# EAGLE design lighting (EAGLE 7.4.0)
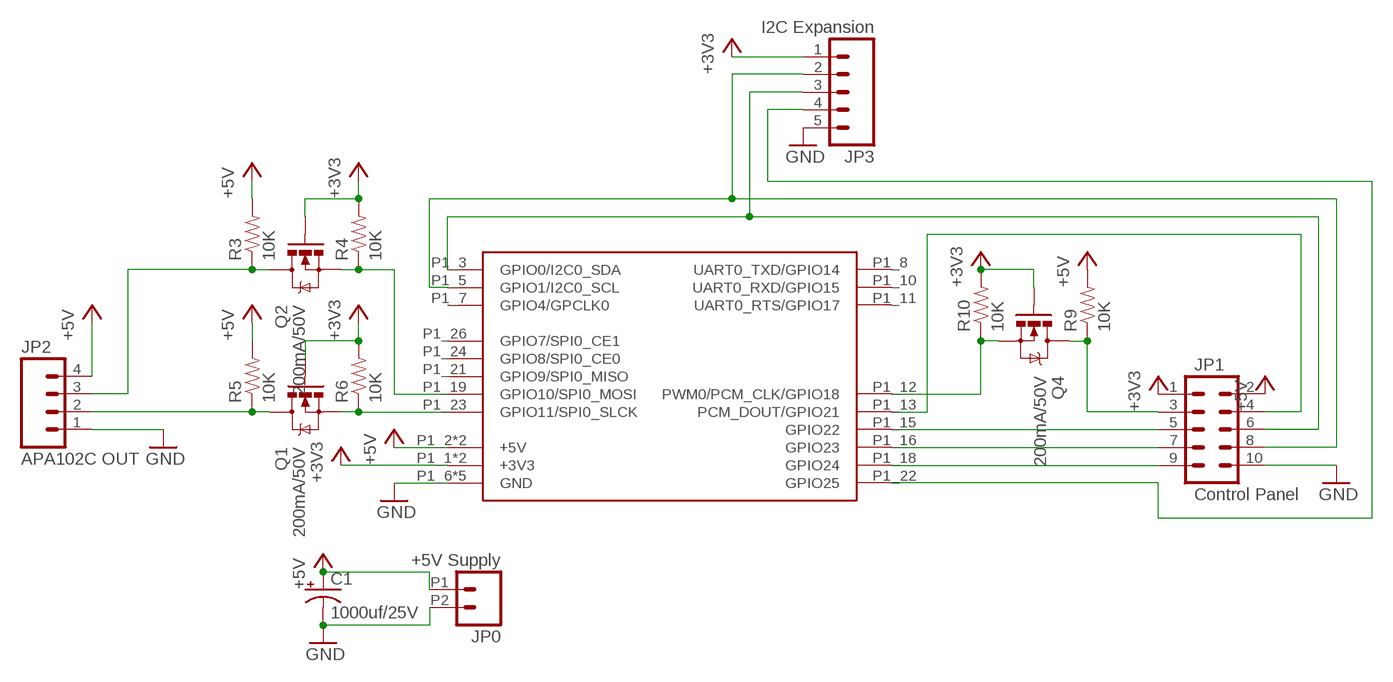
[diagram p0: schematic, sheet 1]

## Parts
C1  1000uf/25V  1000UF-25V(PTH)KIT  [CPOL-RADIAL-1000UF-25V-KIT]
JP0  +5V Supply  M022.54MM_SCREWTERM  [1X02_2.54_SCREWTERM]
JP1  Control Panel  M05X2SHD_LOCK  [2X5-SHROUDED_LOCK]
JP2  APA102C OUT  M04POLAR_LOCK  [MOLEX-1X4_LOCK]
JP3  I2C Expansion  M05LOCK  [1X05_LOCK]
Q1  200mA/50V  MOSFET-NCHANNELBSS138  [SOT23-3]
Q2  200mA/50V  MOSFET-NCHANNELBSS138  [SOT23-3]
Q4  200mA/50V  MOSFET-NCHANNELBSS138  [SOT23-3]
R3  10K  10KOHM-1/10W-1%(0603)0603  [0603-RES]
R4  10K  10KOHM-1/10W-1%(0603)0603  [0603-RES]
R5  10K  10KOHM-1/10W-1%(0603)0603  [0603-RES]
R6  10K  10KOHM-1/10W-1%(0603)0603  [0603-RES]
R9  10K  10KOHM-1/10W-1%(0603)0603  [0603-RES]
R10  10K  10KOHM-1/10W-1%(0603)0603  [0603-RES]
U$1  RPI-B-V1  [RPI-B-V1]

## Nets
+3V3 [Power]: JP1.1 JP3.1 Q1.1(G) Q2.1(G) Q4.1(G) R4.2 R6.2 R10.2 U$1.P1_1(+3V3) U$1.P1_17(+3V3)
+5V [Power]: C1.+ JP0.P1 JP1.2 JP2.4 R3.2 R5.2 R9.2 U$1.P1_2(+5V) U$1.P1_4(+5V)
GND [Power]: C1.- JP0.P2 JP1.10 JP2.1 JP3.5 U$1.P1_6(GND) U$1.P1_9(GND) U$1.P1_14(GND) U$1.P1_20(GND) U$1.P1_25(GND)
N$1: Q2.2(S) R4.1 U$1.P1_19(GPIO10/SPI0_MOSI)
N$2: JP1.5 U$1.P1_15(GPIO22)
N$3: JP1.7 U$1.P1_16(GPIO23)
N$4: JP1.9 U$1.P1_18(GPIO24)
N$5: JP1.6 JP3.3 U$1.P1_3(GPIO0/I2C0_SDA)
N$6: JP1.8 JP3.2 U$1.P1_5(GPIO1/I2C0_SCL)
N$7: Q1.2(S) R6.1 U$1.P1_23(GPIO11/SPI0_SLCK)
N$8: JP3.4 U$1.P1_22(GPIO25)
N$9: JP2.3 Q2.3(D) R3.1
N$11: JP2.2 Q1.3(D) R5.1
N$13: JP1.4 U$1.P1_13(PCM_DOUT/GPIO21)
N$15: JP1.3 Q4.3(D) R9.1
N$16: Q4.2(S) R10.1 U$1.P1_12(PWM0/PCM_CLK/GPIO18)
Unconnected: U$1.P1_7(GPIO4/GPCLK0) U$1.P1_8(UART0_TXD/GPIO14) U$1.P1_10(UART0_RXD/GPIO15) U$1.P1_11(UART0_RTS/GPIO17) U$1.P1_21(GPIO9/SPI0_MISO) U$1.P1_24(GPIO8/SPI0_CE0) U$1.P1_26(GPIO7/SPI0_CE1)

## Library data of the parts
C1 = SparkFun-Capacitors:1000UF-25V(PTH): CAP-08070; PROD_ID: CAP-09538
JP0 = SparkFun-Connectors:M02: Standard 2-pin 0.1" header. Use with - straight break away headers ( PRT-00116) - right angle break away headers (PRT-00553) - swiss pins (PRT-00743) - machine pins (PRT-00117) - female headers (PRT-00115) Molex polarized connector foot print use with: PRT-08233 with associated crimp pins and housings. 2.54_SCREWTERM for use with PRT-10571. 3.5mm Screw Terminal footprints for PRT-08084 5mm Screw Terminal footprints for use with PRT-08432
JP1 = SparkFun-Connectors:M05X2: Header 5x2 Standard 10-pin dual row 0.1" header. Commonly used with AVR-ISP. Use with Spark Fun Electronics SKU: PRT-00778
JP2 = SparkFun-Connectors:M04: Header 4 Standard 4-pin 0.1" header. Use with straight break away headers (SKU : PRT-00116), right angle break away headers (PRT-00553), swiss pins (PRT-00743), machine pins (PRT-00117), and female headers (PRT-00115). Molex polarized connector foot print use with SKU : PRT-08231 with associated crimp pins and housings. 1MM SMD Version SKU: PRT-10208
JP3 = SparkFun-Connectors:M05: Header 5 Standard 5-pin 0.1" header. Use with straight break away headers (SKU : PRT-00116), right angle break away headers (PRT-00553), swiss pins (PRT-00743), machine pins (PRT-00117), and female headers (PRT-00115). Molex polarized connector foot print use with SKU : PRT-08230 with associated crimp pins and housings.
Q1 Q2 Q4 = SparkFun-DiscreteSemi:MOSFET-NCHANNEL: Common NMOSFET Parts MFG P/N Store ID Prod ID FDD8780 TRANS-09984 SI7820DN TRANS-11055 FDS6630A IC-08089 2N7002PW TRANS-11151 FQP30N06L COM-10213 TRANS-10060 BSS123LT1G TRANS-08345 BSS138 TRANS-00830 BS170 2N7000; PROD_ID: TRANS-00830
R3-R6 R9 R10 = SparkFun-Resistors:10KOHM-1/10W-1%(0603): RES-00824; PROD_ID: RES-00824
U$1 = raspberry:RPI-B-V1: First revision of the Model B board without P5 and P6 headers and mounting holes. Choose the "SHIELD" variant for a predefined Dimension layer.

## Net classes
1 Power: width 0.254 mm

## Board
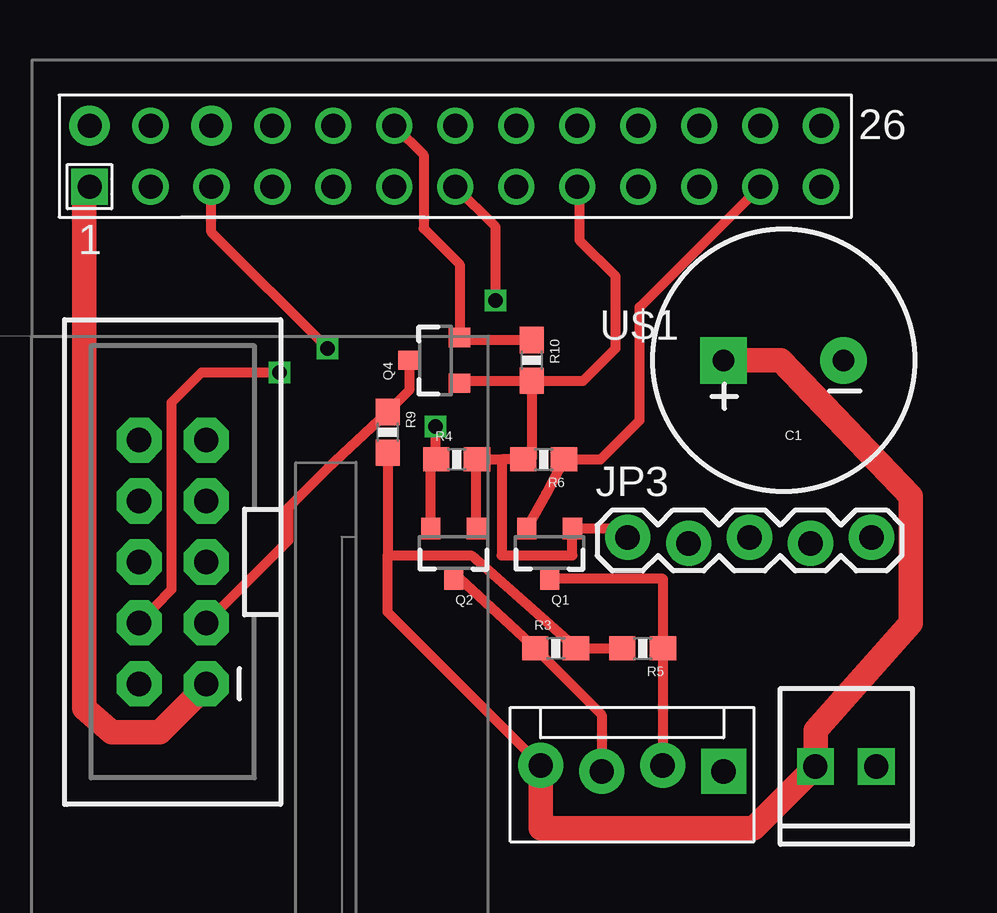
[diagram p1: board, top side]
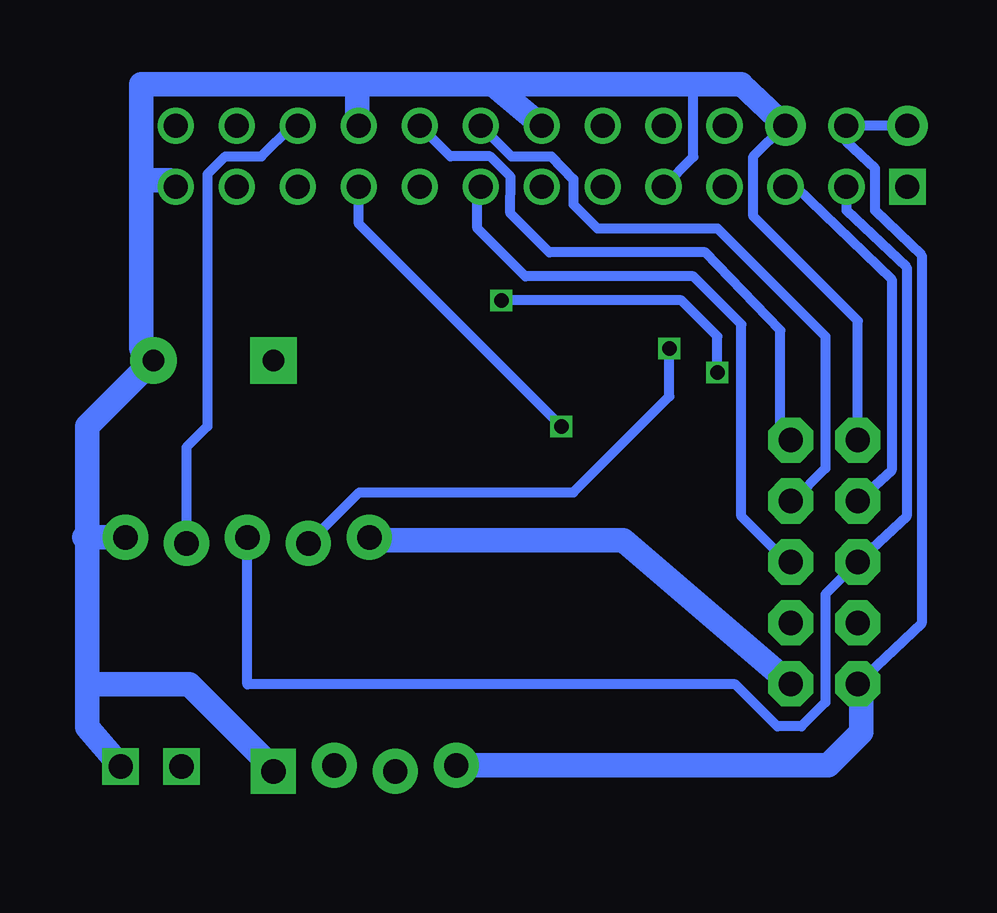
[diagram p2: board, bottom side, seen from below]

No outline drawn. Coordinates in mm, seen from the top.
Copper layers (1*16): Top 0.035mm / dielectric 1.5mm / Bottom 0.035mm
Design rules "dirt_cheap_dirty_boards.v1": minimum track width 5mil, minimum drill 12mil, track to track 5mil, track to pad 5mil, pad to pad 5mil, via to via 5mil, smd to smd 0mil, copper to edge 10mil, drill to drill 10mil, minimum pad ring 10mil, minimum via ring 6mil, stop-mask expansion 2mil, vias tented up to drill 25mil, thermal gap 10mil

### Footprints (pad centres in the part's own frame; a part is rotated, then mirrored left to right if it is on the bottom)
CPOL-RADIAL-1000UF-25V-KIT = drill 0.9 pad 1.93 square: + 2.5,0 | drill 0.9 pad 1.93: - -2.5,0
1X02_2.54_SCREWTERM = drill 1.016 square: P1 2.54,0; P2 0,0
2X5-SHROUDED_LOCK = drill 1.016 pad 1.88 octagon: 1 -1.397,5.08; 2 1.397,5.08; 3 -1.397,2.54; 4 1.397,2.54; 5 -1.397,0; 6 1.397,0; 7 -1.397,-2.54; 8 1.397,-2.54; 9 -1.397,-5.08; 10 1.397,-5.08
MOLEX-1X4_LOCK = drill 1.016 pad 1.88 square: 1 0,0.127 | drill 1.016 pad 1.88: 2 2.54,-0.127; 3 5.08,0.127; 4 7.62,-0.127
1X05_LOCK = drill 1.016 pad 1.88: 1 0,0.127; 2 2.54,-0.127; 3 5.08,0.127; 4 7.62,-0.127; 5 10.16,0.127
SOT23-3 = smd 0.8 x 0.9: 1 -0.95,-1; 2 0.95,-1; 3 0,1.1
0603-RES = smd 1.1 x 1: 1 -0.85,0; 2 0.85,0
RPI-B-V1 = drill 1 square: P1_1 2.54,3.81 | drill 1 pad 1.676: P1_2 2.54,6.35; P1_6 7.62,6.35 | drill 1: P1_3 5.08,3.81; P1_4 5.08,6.35; P1_5 7.62,3.81; P1_7 10.16,3.81; P1_8 10.16,6.35; P1_9 12.7,3.81; P1_10 12.7,6.35; P1_11 15.24,3.81; P1_12 15.24,6.35; P1_13 17.78,3.81; P1_14 17.78,6.35; P1_15 20.32,3.81; P1_16 20.32,6.35; P1_17 22.86,3.81; P1_18 22.86,6.35; P1_19 25.4,3.81; P1_20 25.4,6.35; P1_21 27.94,3.81; P1_22 27.94,6.35; P1_23 30.48,3.81; P1_24 30.48,6.35; P1_25 33.02,3.81; P1_26 33.02,6.35

### Placement (x,y rotation side)
C1  31,20.5 180 top
JP0  34.86,3.58 180 top
JP1  5.54,12.1 180 top
JP2  28.5,3.5 180 top
JP3  24.5,13 0 top
Q1  21.25,12.5 180 top
Q2  17.25,12.5 180 top
Q4  16.5,20.5 90 top
R3  21.5,8.5 0 top
R4  17.38,16.38 0 top
R5  25.12,8.5 180 top
R6  21,16.38 180 top
R9  14.5,17.5 270 top
R10  20.5,20.5 270 top
U$1  -0.46,23.93 0 top

### Tracks (layer width: path | path; a pad name or v marks a point on that pad's centre or on a via)
+3V3
  Top 0.254: 22.49,27.64 U$1.P1_17
  Top 0.406: Q2.1 18.2,16.35 R4.2 19.25,16.38 | 19.25,16.38 R6.2 20.5,16.38 R10.2 | 19.25,16.38 19.25,12.38 22.2,12.38 Q1.1 24,13.5 JP3.1 | R10.2 22.65,19.65 24,21 24,24 22.49,25.51 22.49,27.64 | Q4.1 17.6,19.65 R10.2 | U$1.P1_1 1.86,27.66 | 6.94,6.94 JP1.1
  Top 1.016: 1.86,27.66 1.86,6 3,5 5,5 6.94,6.94
  Bottom 0.406: 24,13 24,13.13 JP3.1
  Bottom 1.016: JP1.1 13.92,13 24,13
+5V
  Top 0.406: R5.2 R3.2 17.98,12.38 14.5,12.38 | JP0.P1 | R9.2 14.5,12.38 | JP2.4 14.5,10.01 14.5,12.38
  Top 1.016: JP0.P1 32.33,5.08 36.3,9.55 36.3,14.83 30.89,20.5 C1.+ | JP2.4 20.88,1 29.75,1 JP0.P1
  Bottom 0.406: U$1.P1_2 U$1.P1_4 4.62,29.62 3.43,28.5 3.43,26.75 1.49,24.88 1.49,9.54 JP1.2 4,6.87 | JP2.4 20.88,3
  Bottom 1.016: 4,6.87 4,5 5.37,3.63 JP2.4
GND
  Bottom 0.406: U$1.P1_20 25,30.34 | U$1.P1_25 32.82,28 | 36.25,13.25 36.37,12.87 36.37,13.13 | U$1.P1_9 11,28.98 11,32 | JP1.10 4.15,22.15 8.5,26.5 8.5,29 7.22,30.28 U$1.P1_6
  Bottom 1.016: U$1.P1_6 9,32 11,32 19.38,32 | U$1.P1_14 19.38,32 | 25,30.34 25,32 | 25,32 19.38,32 | 34,28 34,32 25,32 | 32.82,28 34,28 | 34,28 34,21 C1.- 36.25,17.75 36.25,13.25 36.25,7 | JP0.P2 36.25,5.22 36.25,7 | JP3.5 36.37,13.13 | JP2.1 28.5,3.5 32,7 36.25,7
N$1  (via drill 0.6)
  Top 0.406: Q2.2 16.3,16.15 R4.1 16.5,16.4 v16.5,17.75
  Bottom 0.406: v16.5,17.75 24.94,26.19 U$1.P1_19
N$2
  Bottom 0.406: JP1.5 7.1,12.1 9,14 9,22 11,24 18,24 20,26 20,27.6 U$1.P1_15
N$3
  Bottom 0.406: U$1.P1_16 18.58,29 16.91,29 16,28.06 16,27 15,26 10,26 5.5,21.5 5.5,16 6.86,14.64 JP1.7
N$4
  Bottom 0.406: JP1.9 7.38,17.74 7.38,21.75 10.5,25 17,25 18.62,26.62 18.61,28.15 19.47,29 21.12,29 U$1.P1_18
N$5
  Bottom 0.406: U$1.P1_3 4.62,26.75 2.12,24.38 2.12,14 JP1.6 5.5,10.75 5.5,6.25 6.5,5.25 7.5,5.25 9.25,7 29.58,7 JP3.3
N$6  (via drill 0.6)
  Top 0.406: v12,21 7.16,25.84 U$1.P1_5
  Bottom 0.406: U$1.P1_5 6.74,27.74 2.74,23.88 2.74,15.91 JP1.8 | JP3.2 24.91,15 16,15 12,19 v12,21
N$7
  Top 0.406: Q1.2 21.1,14.95 R6.1 23.38,16.38 25,18 25,22.72 U$1.P1_23
N$8
  Bottom 0.406: U$1.P1_22 27.72,30.28 29,29 30.5,29 31.25,28.25 31.25,17.75 32.12,16.88 JP3.4
N$9
  Top 0.406: JP2.3 23.42,5.73 R3.1 17.5,11.4 Q2.3
N$11
  Top 0.406: JP2.2 25.96,8.48 R5.1 25.98,11.4 Q1.3
N$13  (via drill 0.6)
  Top 0.406: JP1.4 5.5,10.96 5.5,18.75 6.75,20 v10,20 | v19,23 19,26.06 U$1.P1_13
  Bottom 0.406: v10,20 10,21.5 11.5,23 v19,23
N$15
  Top 0.406: Q4.3 15.4,19.25 R9.1 14.15,18 12,16 10.38,14.38 10.38,13 JP1.3
N$16
  Top 0.406: U$1.P1_12 16,29.06 16,26 17.5,24.5 Q4.2 17.6,21.35 R10.1